# Altium schematic sheet 5V Sheet.SchDoc
size A4
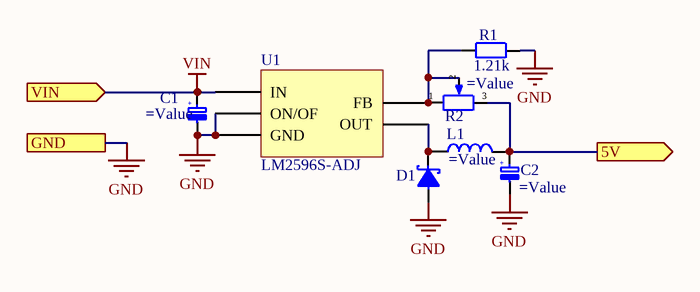
[diagram p0: 5V Sheet.SchDoc]

## Parts
C1  (no value)  [D8C3.2H12]
C2  (no value)  [D8C3.2H12]
D1  MBRS340T3G  [DO214AB(SMC)]  (value not drawn)
L1  (no value)  [SRR1280]
R1  1.21k  [res0603]
R2  (no value)  [3224W]
U1  LM2596S-ADJ  [TO263-5L]

## Ports
5V (out), GND, VIN (in)

## Nets
GND: C1.1(MINUS) C2.2(MINUS) D1.1 R1.2 U1.3(GND) U1.5(ON/OF) ; port GND
VIN: C1.2(PLUS) U1.1(IN) ; port VIN
5V: C2.1(PLUS) L1.2 R2.3 ; port 5V
NetD1_2: D1.2 L1.1 U1.2(OUT)
NetR1_1: R1.1 R2.1 R2.2 U1.4(FB)

## Notes on the sheet
- (in symbol Cap Electrolytic) +
- (in symbol Cap Tantal) +

## Library data of the parts
C1 = Cap Tantal: pin to pad: 1>2 2>1
C2 = Cap Electrolytic
L1 = Inductor
R1 = Resistor SMD
R2 = Potentiometer